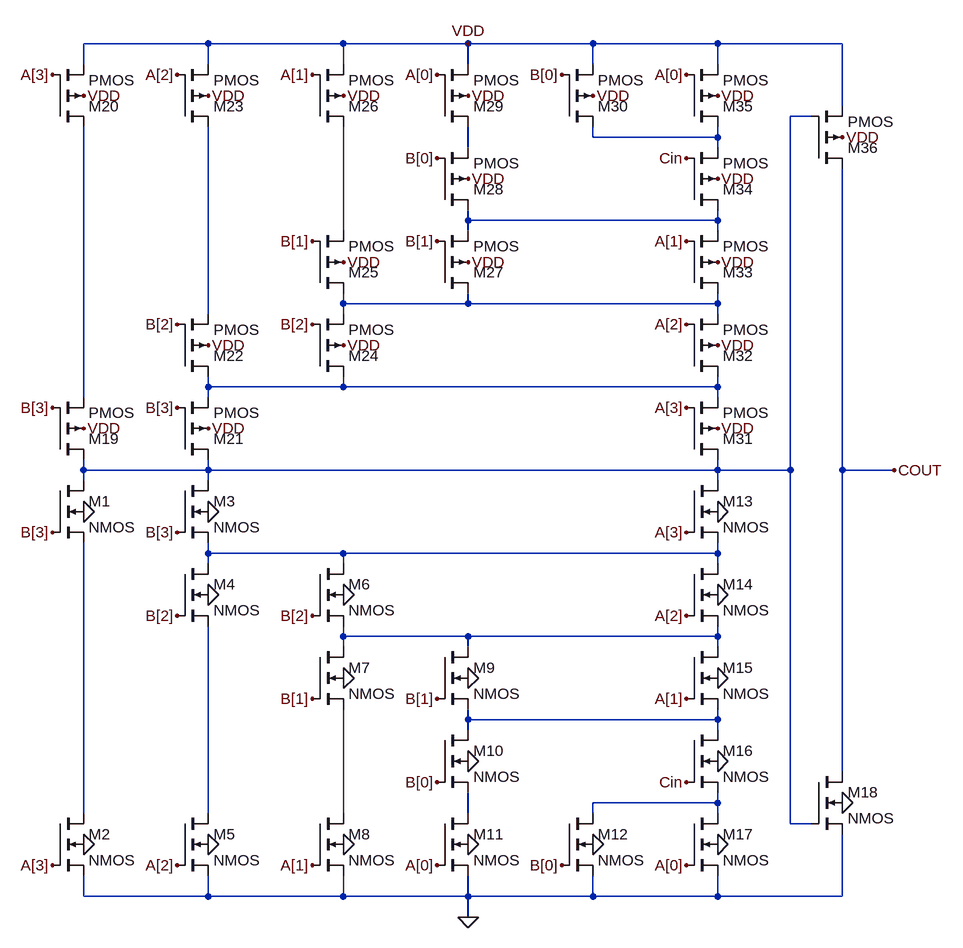
[diagram p0: schematic COUT.asc]
COUT.asc, the LTspice schematic file:
Version 4
SHEET 1 1732 680
WIRE 560 -720 368 -720
WIRE 768 -720 560 -720
WIRE 960 -720 768 -720
WIRE 1152 -720 960 -720
WIRE 1344 -720 1152 -720
WIRE 1536 -720 1344 -720
WIRE 368 -688 368 -720
WIRE 560 -688 560 -720
WIRE 768 -688 768 -720
WIRE 960 -688 960 -720
WIRE 1152 -688 1152 -720
WIRE 1344 -688 1344 -720
WIRE 1536 -624 1536 -720
WIRE 1488 -608 1456 -608
WIRE 1152 -576 1152 -592
WIRE 1344 -576 1344 -592
WIRE 1344 -576 1152 -576
WIRE 960 -560 960 -592
WIRE 1344 -560 1344 -576
WIRE 960 -448 960 -464
WIRE 1344 -448 1344 -464
WIRE 1344 -448 960 -448
WIRE 768 -432 768 -592
WIRE 960 -432 960 -448
WIRE 1344 -432 1344 -448
WIRE 768 -320 768 -336
WIRE 960 -320 960 -336
WIRE 960 -320 768 -320
WIRE 1344 -320 1344 -336
WIRE 1344 -320 960 -320
WIRE 560 -304 560 -592
WIRE 768 -304 768 -320
WIRE 1344 -304 1344 -320
WIRE 560 -192 560 -208
WIRE 768 -192 768 -208
WIRE 768 -192 560 -192
WIRE 1344 -192 1344 -208
WIRE 1344 -192 768 -192
WIRE 368 -176 368 -592
WIRE 560 -176 560 -192
WIRE 1344 -176 1344 -192
WIRE 368 -64 368 -80
WIRE 560 -64 560 -80
WIRE 560 -64 368 -64
WIRE 1344 -64 1344 -80
WIRE 1344 -64 560 -64
WIRE 1456 -64 1456 -608
WIRE 1456 -64 1344 -64
WIRE 1536 -64 1536 -528
WIRE 1616 -64 1536 -64
WIRE 368 -48 368 -64
WIRE 560 -48 560 -64
WIRE 1344 -48 1344 -64
WIRE 560 64 560 48
WIRE 768 64 560 64
WIRE 1344 64 1344 48
WIRE 1344 64 768 64
WIRE 560 80 560 64
WIRE 768 80 768 64
WIRE 1344 80 1344 64
WIRE 768 192 768 176
WIRE 960 192 768 192
WIRE 1344 192 1344 176
WIRE 1344 192 960 192
WIRE 768 208 768 192
WIRE 960 208 960 192
WIRE 1344 208 1344 192
WIRE 960 320 960 304
WIRE 1344 320 1344 304
WIRE 1344 320 960 320
WIRE 960 336 960 320
WIRE 1344 336 1344 320
WIRE 1536 400 1536 -64
WIRE 1344 448 1344 432
WIRE 1344 448 1152 448
WIRE 368 464 368 48
WIRE 560 464 560 176
WIRE 768 464 768 304
WIRE 960 464 960 432
WIRE 1152 464 1152 448
WIRE 1344 464 1344 448
WIRE 1456 480 1456 -64
WIRE 1488 480 1456 480
WIRE 368 592 368 560
WIRE 560 592 560 560
WIRE 560 592 368 592
WIRE 768 592 768 560
WIRE 768 592 560 592
WIRE 960 592 960 560
WIRE 960 592 768 592
WIRE 1152 592 1152 560
WIRE 1152 592 960 592
WIRE 1344 592 1344 560
WIRE 1344 592 1152 592
WIRE 1536 592 1536 496
WIRE 1536 592 1344 592
WIRE 960 624 960 592
FLAG 960 624 0
FLAG 1152 512 0
FLAG 1344 512 0
FLAG 1344 384 0
FLAG 1536 448 0
FLAG 1344 256 0
FLAG 1344 128 0
FLAG 1344 0 0
FLAG 960 256 0
FLAG 960 384 0
FLAG 960 512 0
FLAG 768 512 0
FLAG 768 256 0
FLAG 768 128 0
FLAG 560 128 0
FLAG 560 0 0
FLAG 560 512 0
FLAG 368 512 0
FLAG 368 0 0
FLAG 1536 -576 VDD
FLAG 1344 -640 VDD
FLAG 960 -720 VDD
FLAG 1344 -512 VDD
FLAG 1344 -384 VDD
FLAG 1344 -256 VDD
FLAG 1344 -128 VDD
FLAG 1152 -640 VDD
FLAG 960 -640 VDD
FLAG 960 -512 VDD
FLAG 960 -384 VDD
FLAG 768 -640 VDD
FLAG 768 -384 VDD
FLAG 768 -256 VDD
FLAG 560 -256 VDD
FLAG 560 -128 VDD
FLAG 560 -640 VDD
FLAG 368 -640 VDD
FLAG 368 -128 VDD
FLAG 1296 -672 A[0]
FLAG 1296 544 A[0]
FLAG 912 -672 A[0]
FLAG 912 544 A[0]
FLAG 1296 288 A[1]
FLAG 720 544 A[1]
FLAG 720 -672 A[1]
FLAG 1296 -416 A[1]
FLAG 1296 160 A[2]
FLAG 1296 -288 A[2]
FLAG 512 -672 A[2]
FLAG 512 544 A[2]
FLAG 320 544 A[3]
FLAG 320 -672 A[3]
FLAG 1296 -160 A[3]
FLAG 1296 32 A[3]
FLAG 1104 544 B[0]
FLAG 912 416 B[0]
FLAG 1104 -672 B[0]
FLAG 912 -544 B[0]
FLAG 912 288 B[1]
FLAG 912 -416 B[1]
FLAG 720 -416 B[1]
FLAG 720 288 B[1]
FLAG 720 160 B[2]
FLAG 512 160 B[2]
FLAG 720 -288 B[2]
FLAG 512 -288 B[2]
FLAG 512 -160 B[3]
FLAG 512 32 B[3]
FLAG 320 32 B[3]
FLAG 320 -160 B[3]
FLAG 1296 416 Cin
FLAG 1296 -544 Cin
FLAG 1616 -64 COUT
SYMBOL nmos4 320 -48 R0
SYMATTR InstName M1
SYMBOL nmos4 320 464 R0
SYMATTR InstName M2
SYMBOL nmos4 512 -48 R0
SYMATTR InstName M3
SYMBOL nmos4 512 80 R0
SYMATTR InstName M4
SYMBOL nmos4 512 464 R0
SYMATTR InstName M5
SYMBOL nmos4 720 80 R0
SYMATTR InstName M6
SYMBOL nmos4 720 208 R0
SYMATTR InstName M7
SYMBOL nmos4 720 464 R0
SYMATTR InstName M8
SYMBOL nmos4 912 208 R0
SYMATTR InstName M9
SYMBOL nmos4 912 336 R0
SYMATTR InstName M10
SYMBOL nmos4 912 464 R0
SYMATTR InstName M11
SYMBOL nmos4 1104 464 R0
SYMATTR InstName M12
SYMBOL nmos4 1296 -48 R0
SYMATTR InstName M13
SYMBOL nmos4 1296 80 R0
SYMATTR InstName M14
SYMBOL nmos4 1296 208 R0
SYMATTR InstName M15
SYMBOL nmos4 1296 336 R0
SYMATTR InstName M16
SYMBOL nmos4 1296 464 R0
SYMATTR InstName M17
SYMBOL nmos4 1488 400 R0
SYMATTR InstName M18
SYMBOL pmos4 320 -80 M180
SYMATTR InstName M19
SYMBOL pmos4 320 -592 M180
SYMATTR InstName M20
SYMBOL pmos4 512 -80 M180
SYMATTR InstName M21
SYMBOL pmos4 512 -208 M180
SYMATTR InstName M22
SYMBOL pmos4 512 -592 M180
SYMATTR InstName M23
SYMBOL pmos4 720 -208 M180
SYMATTR InstName M24
SYMBOL pmos4 720 -336 M180
SYMATTR InstName M25
SYMBOL pmos4 720 -592 M180
SYMATTR InstName M26
SYMBOL pmos4 912 -336 M180
SYMATTR InstName M27
SYMBOL pmos4 912 -464 M180
SYMATTR InstName M28
SYMBOL pmos4 912 -592 M180
SYMATTR InstName M29
SYMBOL pmos4 1104 -592 M180
SYMATTR InstName M30
SYMBOL pmos4 1296 -80 M180
SYMATTR InstName M31
SYMBOL pmos4 1296 -208 M180
SYMATTR InstName M32
SYMBOL pmos4 1296 -336 M180
SYMATTR InstName M33
SYMBOL pmos4 1296 -464 M180
SYMATTR InstName M34
SYMBOL pmos4 1296 -592 M180
SYMATTR InstName M35
SYMBOL pmos4 1488 -528 M180
SYMATTR InstName M36

The netlist it stands for:
* COUT.asc
M1 N001 B[3] N014 0 NMOS
M2 N014 A[3] 0 0 NMOS
M3 N001 B[3] N010 0 NMOS
M4 N010 B[2] N015 0 NMOS
M5 N015 A[2] 0 0 NMOS
M6 N010 B[2] N011 0 NMOS
M7 N011 B[1] N016 0 NMOS
M8 N016 A[1] 0 0 NMOS
M9 N011 B[1] N012 0 NMOS
M10 N012 B[0] N017 0 NMOS
M11 N017 A[0] 0 0 NMOS
M12 N013 B[0] 0 0 NMOS
M13 N001 A[3] N010 0 NMOS
M14 N010 A[2] N011 0 NMOS
M15 N011 A[1] N012 0 NMOS
M16 N012 Cin N013 0 NMOS
M17 N013 A[0] 0 0 NMOS
M18 COUT N001 0 0 NMOS
M19 N001 B[3] N009 VDD PMOS
M20 N009 A[3] VDD VDD PMOS
M21 N001 B[3] N008 VDD PMOS
M22 N008 B[2] N007 VDD PMOS
M23 N007 A[2] VDD VDD PMOS
M24 N008 B[2] N006 VDD PMOS
M25 N006 B[1] N005 VDD PMOS
M26 N005 A[1] VDD VDD PMOS
M27 N006 B[1] N004 VDD PMOS
M28 N004 B[0] N003 VDD PMOS
M29 N003 A[0] VDD VDD PMOS
M30 N002 B[0] VDD VDD PMOS
M31 N001 A[3] N008 VDD PMOS
M32 N008 A[2] N006 VDD PMOS
M33 N006 A[1] N004 VDD PMOS
M34 N004 Cin N002 VDD PMOS
M35 N002 A[0] VDD VDD PMOS
M36 COUT N001 VDD VDD PMOS
.model NMOS NMOS
.model PMOS PMOS
.lib standard.mos
.backanno
.end